# EAGLE design Trackballer-v12 (EAGLE 5.11)
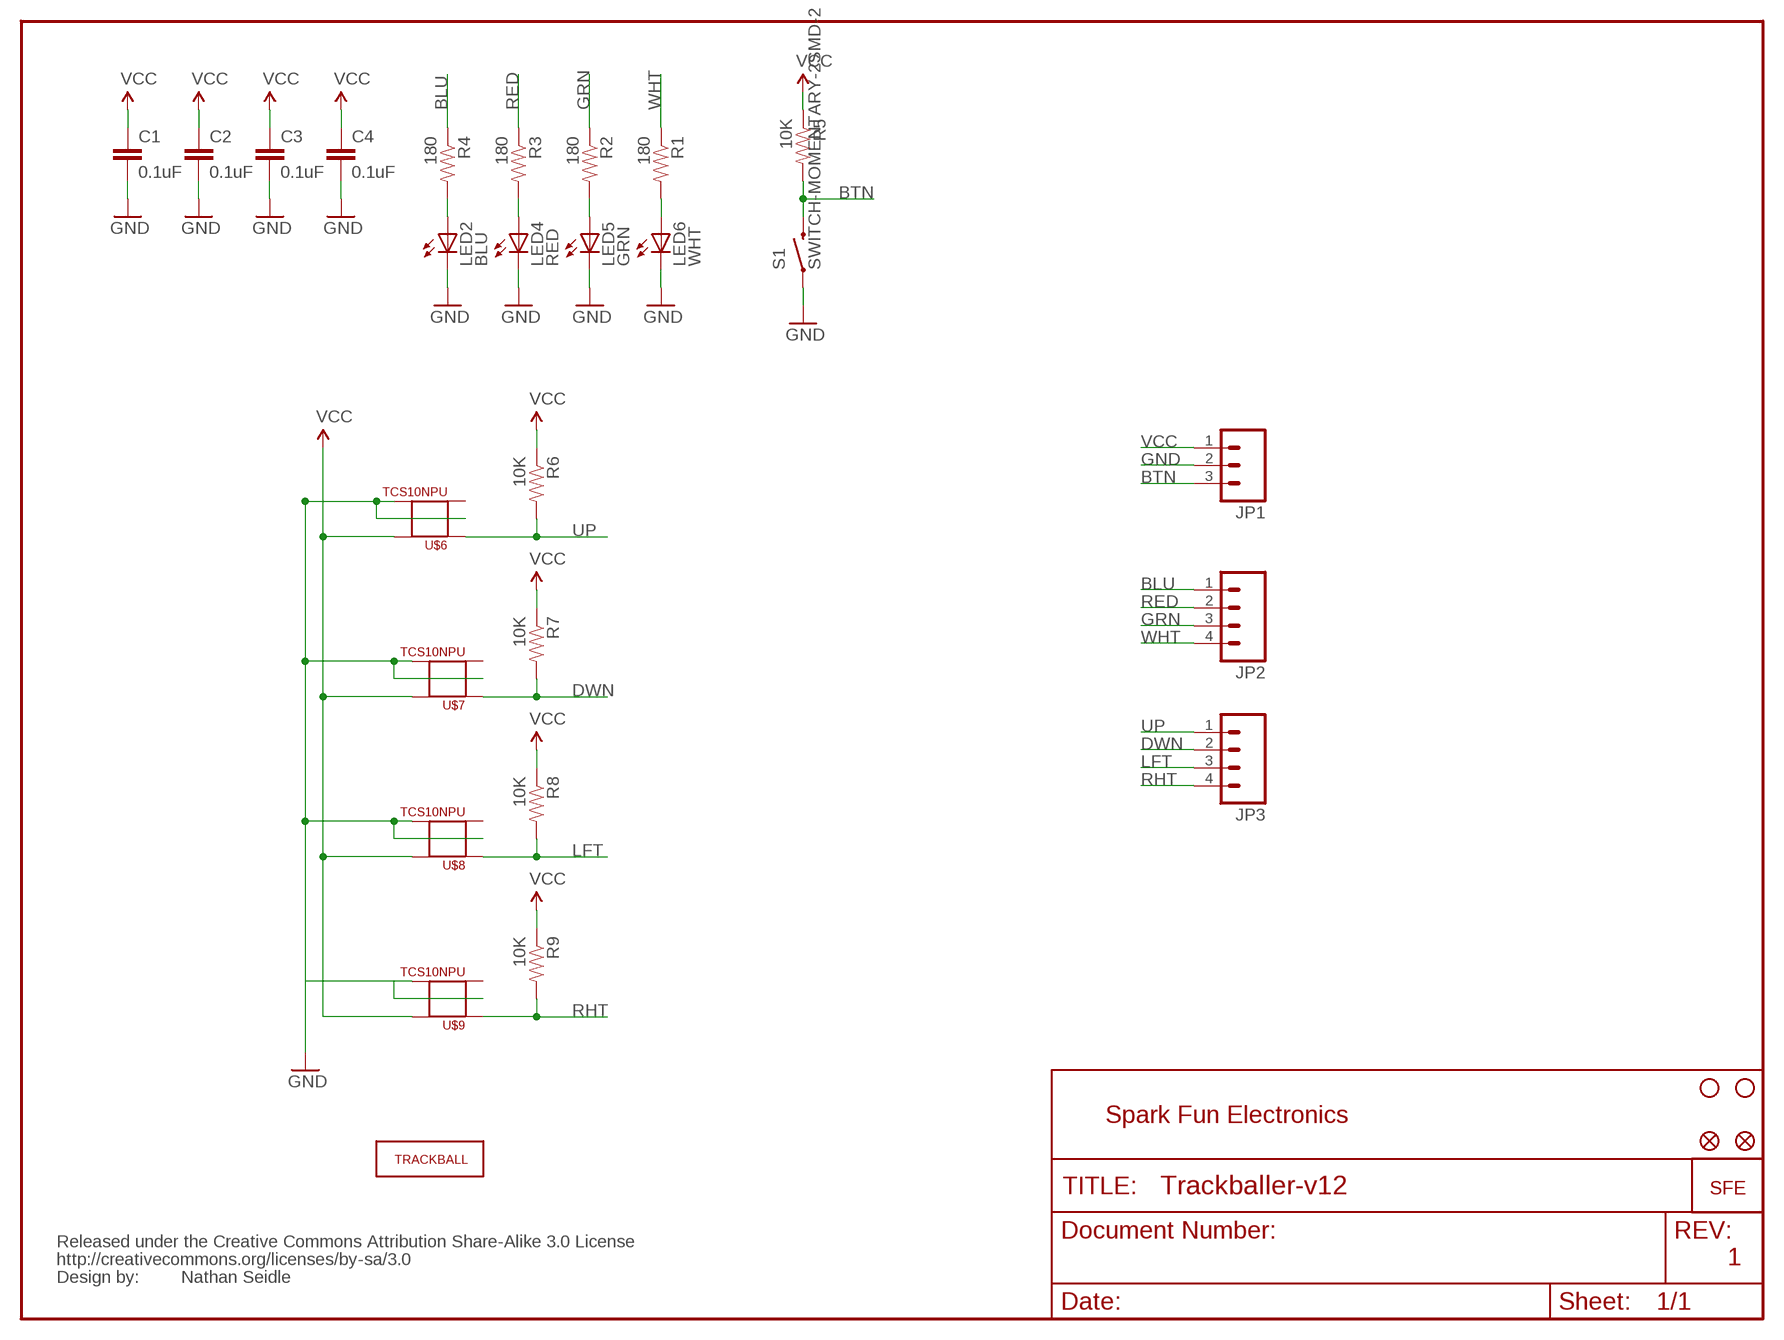
[diagram p0: schematic, sheet 1]

## Parts
C1  0.1uF  CAP0402-CAP  [0402-CAP]
C2  0.1uF  CAP0402-CAP  [0402-CAP]
C3  0.1uF  CAP0402-CAP  [0402-CAP]
C4  0.1uF  CAP0402-CAP  [0402-CAP]
E$1  FIDUCIAL1X2  [FIDUCIAL-1X2]
E$2  FIDUCIAL1X2  [FIDUCIAL-1X2]
JP1  M03PTH  [1X03]
JP2  M04PTH  [1X04]
JP3  M04PTH  [1X04]
LED2  BLU  LED0603  [LED-0603]
LED4  RED  LED0603  [LED-0603]
LED5  GRN  LED0603  [LED-0603]
LED6  WHT  LED0603  [LED-0603]
R1  180  RESISTOR0402-RES  [0402-RES]
R2  180  RESISTOR0402-RES  [0402-RES]
R3  180  RESISTOR0402-RES  [0402-RES]
R4  180  RESISTOR0402-RES  [0402-RES]
R5  10K  RESISTOR0402-RES  [0402-RES]
R6  10K  RESISTOR0402-RES  [0402-RES]
R7  10K  RESISTOR0402-RES  [0402-RES]
R8  10K  RESISTOR0402-RES  [0402-RES]
R9  10K  RESISTOR0402-RES  [0402-RES]
S1  SWITCH-MOMENTARY-2SMD-2  [TACTILE_SWITCH_SMD-2]
U$1  LOGO-SFENEW  [SFE-NEW-WEBLOGO]
U$2  TRACKBALLMECH  [TRACKBALL]
U$3  STAND-OFF  [STAND-OFF]
U$4  STAND-OFF  [STAND-OFF]
U$5  CREATIVE_COMMONS  [CREATIVE_COMMONS]
U$6  TCS10NPU  [TCS10NPU]
U$7  TCS10NPU  [TCS10NPU]
U$8  TCS10NPU  [TCS10NPU]
U$9  TCS10NPU  [TCS10NPU]

## Nets
BLU: JP2.1 R4.1
BTN: JP1.3 R5.2 S1.1
DWN: JP3.2 R7.2 U$7.1
GND: C1.2 C2.2 C3.2 C4.2 JP1.2 LED2.C LED4.C LED5.C LED6.C S1.2 U$6.2 U$6.4 U$7.2 U$7.4 U$8.2 U$8.4 U$9.2 U$9.4
GRN: JP2.3 R2.1
LFT: JP3.3 R8.2 U$8.1
N$1: LED5.A R2.2
N$2: LED4.A R3.2
N$3: LED2.A R4.2
N$4: LED6.A R1.2
RED: JP2.2 R3.1
RHT: JP3.4 R9.2 U$9.1
UP: JP3.1 R6.2 U$6.1
VCC: C1.1 C2.1 C3.1 C4.1 JP1.1 R5.1 R6.1 R7.1 R8.1 R9.1 U$6.5 U$7.5 U$8.5 U$9.5
WHT: JP2.4 R1.1
Unconnected: U$6.3 U$7.3 U$8.3 U$9.3

## Notes on the sheet
- Spark Fun Electronics
- 1
- Nathan Seidle

## Library data of the parts
C1-C4 = SparkFun:CAP: Capacitor Standard 0603 ceramic capacitor, and 0.1" leaded capacitor.
E$1 E$2 = SparkFun:FIDUCIAL: Fiducial Alignment Points Various fiducial points for machine vision alignment.
JP1 = SparkFun:M03: Header 3 Standard 3-pin 0.1" header. Use with straight break away headers (SKU : PRT-00116), right angle break away headers (PRT-00553), swiss pins (PRT-00743), machine pins (PRT-00117), and female headers (PRT-00115). Molex polarized connector foot print use with SKU : PRT-08232 with associated crimp pins and housings.
JP2 JP3 = SparkFun:M04: Header 4 Standard 4-pin 0.1" header. Use with straight break away headers (SKU : PRT-00116), right angle break away headers (PRT-00553), swiss pins (PRT-00743), machine pins (PRT-00117), and female headers (PRT-00115). Molex polarized connector foot print use with SKU : PRT-08231 with associated crimp pins and housings.
LED2 LED4-LED6 = SparkFun:LED: LEDs Standard schematic elements and footprints for 5mm, 3mm, 1206, and 0603 sized LEDs. 5mm - Spark Fun Electronics SKU : COM-00529 (and others)
R1-R9 = SparkFun:RESISTOR: Resistor Basic schematic elements and footprints for 0603, 1206, and PTH 1/10th watt (small) resistors.
S1 = SparkFun:SWITCH-MOMENTARY-2
U$1 = SparkFun:LOGO-SFE: Spark Fun Electronics PCB Logo This is the standard Spark Fun Electronics PCB logo.
U$2 = SparkFun:TRACKBALL
U$3 U$4 = SparkFun:STAND-OFF: Stand Off This is the mechanical footprint for a #4 phillips button head screw. Use the keepout ring to avoid running the screw head into surrounding components. SKU : PRT-00447
U$5 = SparkFun:CREATIVE_COMMONS
U$6-U$9 = tcs20dor:TCS10NPU: OMG IT WORKS

## Net classes
0 default: width 0.203 mm
1 power: width 0.203 mm

## Board
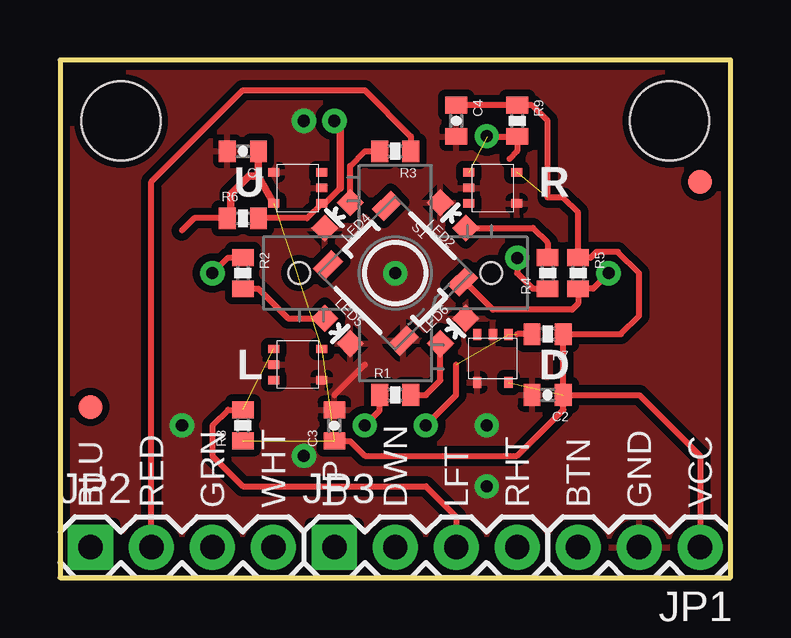
[diagram p1: board, top side]
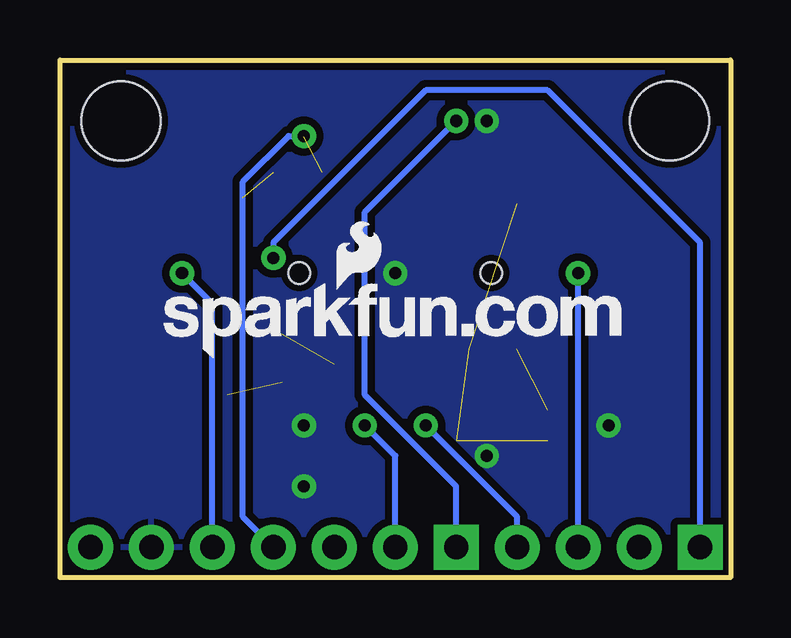
[diagram p2: board, bottom side, seen from below]

Size 27.94 x 21.59 mm. Coordinates in mm from the lower left corner, seen from the top.
Outline: 0,0 27.94,0 27.94,21.59 0,21.59 0,0
Copper layers (1*16): Top 0.035mm / dielectric 1.5mm / Bottom 0.035mm
Design rules "SparkFun": minimum track width 8mil, minimum drill 20mil, track to track 8mil, track to pad 8mil, pad to pad 8mil, via to via 8mil, smd to smd 8mil, copper to edge 10mil, drill to drill 8mil, minimum pad ring 12mil, minimum via ring 10mil, stop-mask expansion 4mil, vias tented up to drill 20mil, thermal gap 10mil

### Footprints (pad centres in the part's own frame; a part is rotated, then mirrored left to right if it is on the bottom)
0402-CAP = smd 0.7 x 0.9: 1 -0.65,0; 2 0.65,0
FIDUCIAL-1X2 = smd 1 x 1: 1 0,0
1X03 = drill 1.016 pad 1.88 round: 1 0,0; 2 2.54,0; 3 5.08,0
1X04 = drill 1.016 pad 1.88 square: 1 0,0 | drill 1.016 pad 1.88 round: 2 2.54,0; 3 5.08,0; 4 7.62,0
LED-0603 = smd 0.8 x 0.8: A 0,-0.75; C 0,0.75
0402-RES = smd 0.7 x 0.9: 1 -0.65,0; 2 0.65,0
TACTILE_SWITCH_SMD-2 = smd 0.7 x 1.1: 1 2.225,1.75; 2 2.225,-1.75; 3 -2.225,-1.75; 4 -2.225,1.75
TRACKBALL = hole 0.9: -4,0; 4,0
STAND-OFF = hole 3.302: 0,0
TCS10NPU = smd 0.45 x 0.35: 1 -1,0.65; 2 -1,0; 3 -1,-0.65; 4 1,-0.65; 5 1,0.65

### Placement (x,y rotation side)
C1  7.62,17.78 180 top
C2  20.32,7.62 180 top
C3  11.43,6.35 90 top
C4  16.51,19.05 270 top
E$1  1.27,7.11 0 top
E$2  26.67,16.51 0 top
JP1  26.67,1.27 180 top
JP2  1.27,1.27 0 top
JP3  11.43,1.27 0 top
LED2  16.38,15.11 45 top
LED4  11.56,15.11 135 top
LED5  11.56,10.29 225 top
LED6  16.38,10.29 315 top
R1  13.97,7.62 0 top
R2  7.62,12.7 270 top
R3  13.97,17.78 180 top
R4  20.32,12.7 90 top
R5  21.59,12.7 270 top
R6  7.62,14.99 0 top
R7  20.32,10.16 180 top
R8  7.62,6.35 90 top
R9  19.05,19.05 270 top
S1  13.97,12.7 315 top
U$1  23.62,9.14 0 bottom
U$2  13.97,12.7 0 top
U$3  25.4,19.05 0 top
U$4  2.54,19.05 0 top
U$5  -7.62,-5.08 0 top  (outside the outline)
U$6  9.91,16.26 180 top
U$7  18.03,9.14 270 top
U$8  9.91,8.89 0 top
U$9  18.03,16.26 0 top

### Tracks (layer width: path | path; a pad name or v marks a point on that pad's centre or on a via)
BLU  (via drill 0.51)
  Top 0.254: R4.1 19.7,12.05 19.05,12.7 v19.05,13.34
  Bottom 0.254: v19.05,13.34 19.05,13.97 12.7,20.32 7.62,20.32 1.27,13.97 JP2.1
BTN  (via drill 0.51)
  Top 0.254: v22.86,12.7 22.21,12.05 R5.2 21.59,11.43 21.34,11.18 18.03,11.18 16.85,12.36 S1.1
  Bottom 0.254: JP1.3 21.59,11.43 v22.86,12.7
DWN  (via drill 0.51)  (2 unrouted)
  Top 0.254: R7.2 19.05,10.16 | v15.24,6.35 16.51,7.62 16.51,8.89
  Bottom 0.254: JP3.2 13.97,5.08 v15.24,6.35
GND  (via drill 0.51)
  Top 0.254: 11.43,7.62 12.7,8.89
  other vias: 10.16,19.05 13.97,12.7 17.78,6.35 17.78,3.81 5.08,6.35 10.16,5.08
  pour Top (isolate 0.305): 0,0 0,21.59 27.94,21.59 27.94,0
  pour Bottom (isolate 0.305): 0,0 0,21.59 27.94,21.59 27.94,0
GRN  (via drill 0.51)
  Top 0.254: R2.1 7,13.35 v6.35,12.7
  Bottom 0.254: JP2.3 v6.35,12.7
LFT  (1 unrouted)
  Top 0.254: JP3.3 16.51,2.54 15.24,3.81 7.62,3.81 6.35,5.08 6.35,6.35 7,7 R8.2
N$1
  Top 0.254: R2.2 8.27,12.05 9.5,10.82 LED5.A
N$2
  Top 0.254: R3.2 12.7,17.78 12.09,17.17 LED4.A
N$3
  Top 0.254: R4.2 20.32,13.97 19.71,14.58 LED2.A
N$4
  Top 0.254: R1.2 15.24,7.62 15.85,8.23 LED6.A
RED
  Top 0.254: JP2.2 3.81,16.51 7.62,20.32 12.7,20.32 14.62,18.4 R3.1
RHT  (via drill 0.51)  (1 unrouted)
  Top 0.254: v17.78,18.41 17.8,18.4 R9.2 19.05,17.78 18.73,17.46
  Bottom 0.254: JP3.4 20.32,2.54 20.32,16.51 18.41,18.41 v17.78,18.41
UP  (via drill 0.51)
  Top 0.254: 11.68,16.26 11.03,15.61 U$6.1 10.29,14.99 R6.2
  Top 0.305: 11.68,16.26 11.68,18.8 v11.43,19.05
  Bottom 0.254: JP3.1 11.43,3.81 15.24,7.62 15.24,15.24 v11.43,19.05
VCC  (5 unrouted)
  Top 0.254: JP1.1 26.67,5.08 24.13,7.62 C2.1 | C2.1 R7.1 23.37,10.16 24.13,10.92 24.13,12.7 23.24,13.59 22.35,13.59 22.11,13.35 R5.1 21.59,15.24 20.97,15.86 20.32,15.86 20.32,19.05 19.67,19.7 R9.1 C4.1 | C2.1 20.97,7 19.05,5.08 12.7,5.08 12.08,5.7 C3.1 | R6.1 5.59,14.99 5.08,14.48
  Top 0.305: 8.27,16.75 U$6.5 | 8.27,16.75 C1.1 | R6.1 7.11,15.38 7.11,16 7.86,16.75 8.27,16.75
WHT  (via drill 0.51)
  Top 0.254: R1.1 13.32,6.97 v12.7,6.35
  Bottom 0.254: JP2.4 8.89,2.54 v12.7,6.35

### Text on the board
tPlace: U | R | L | D | BLU | RED | GRN | WHT | UP | DWN | LFT | RHT | BTN | GND | VCC